# EAGLE design seeknobs5qtpy_22Feb2022 (EAGLE 9.6.2)
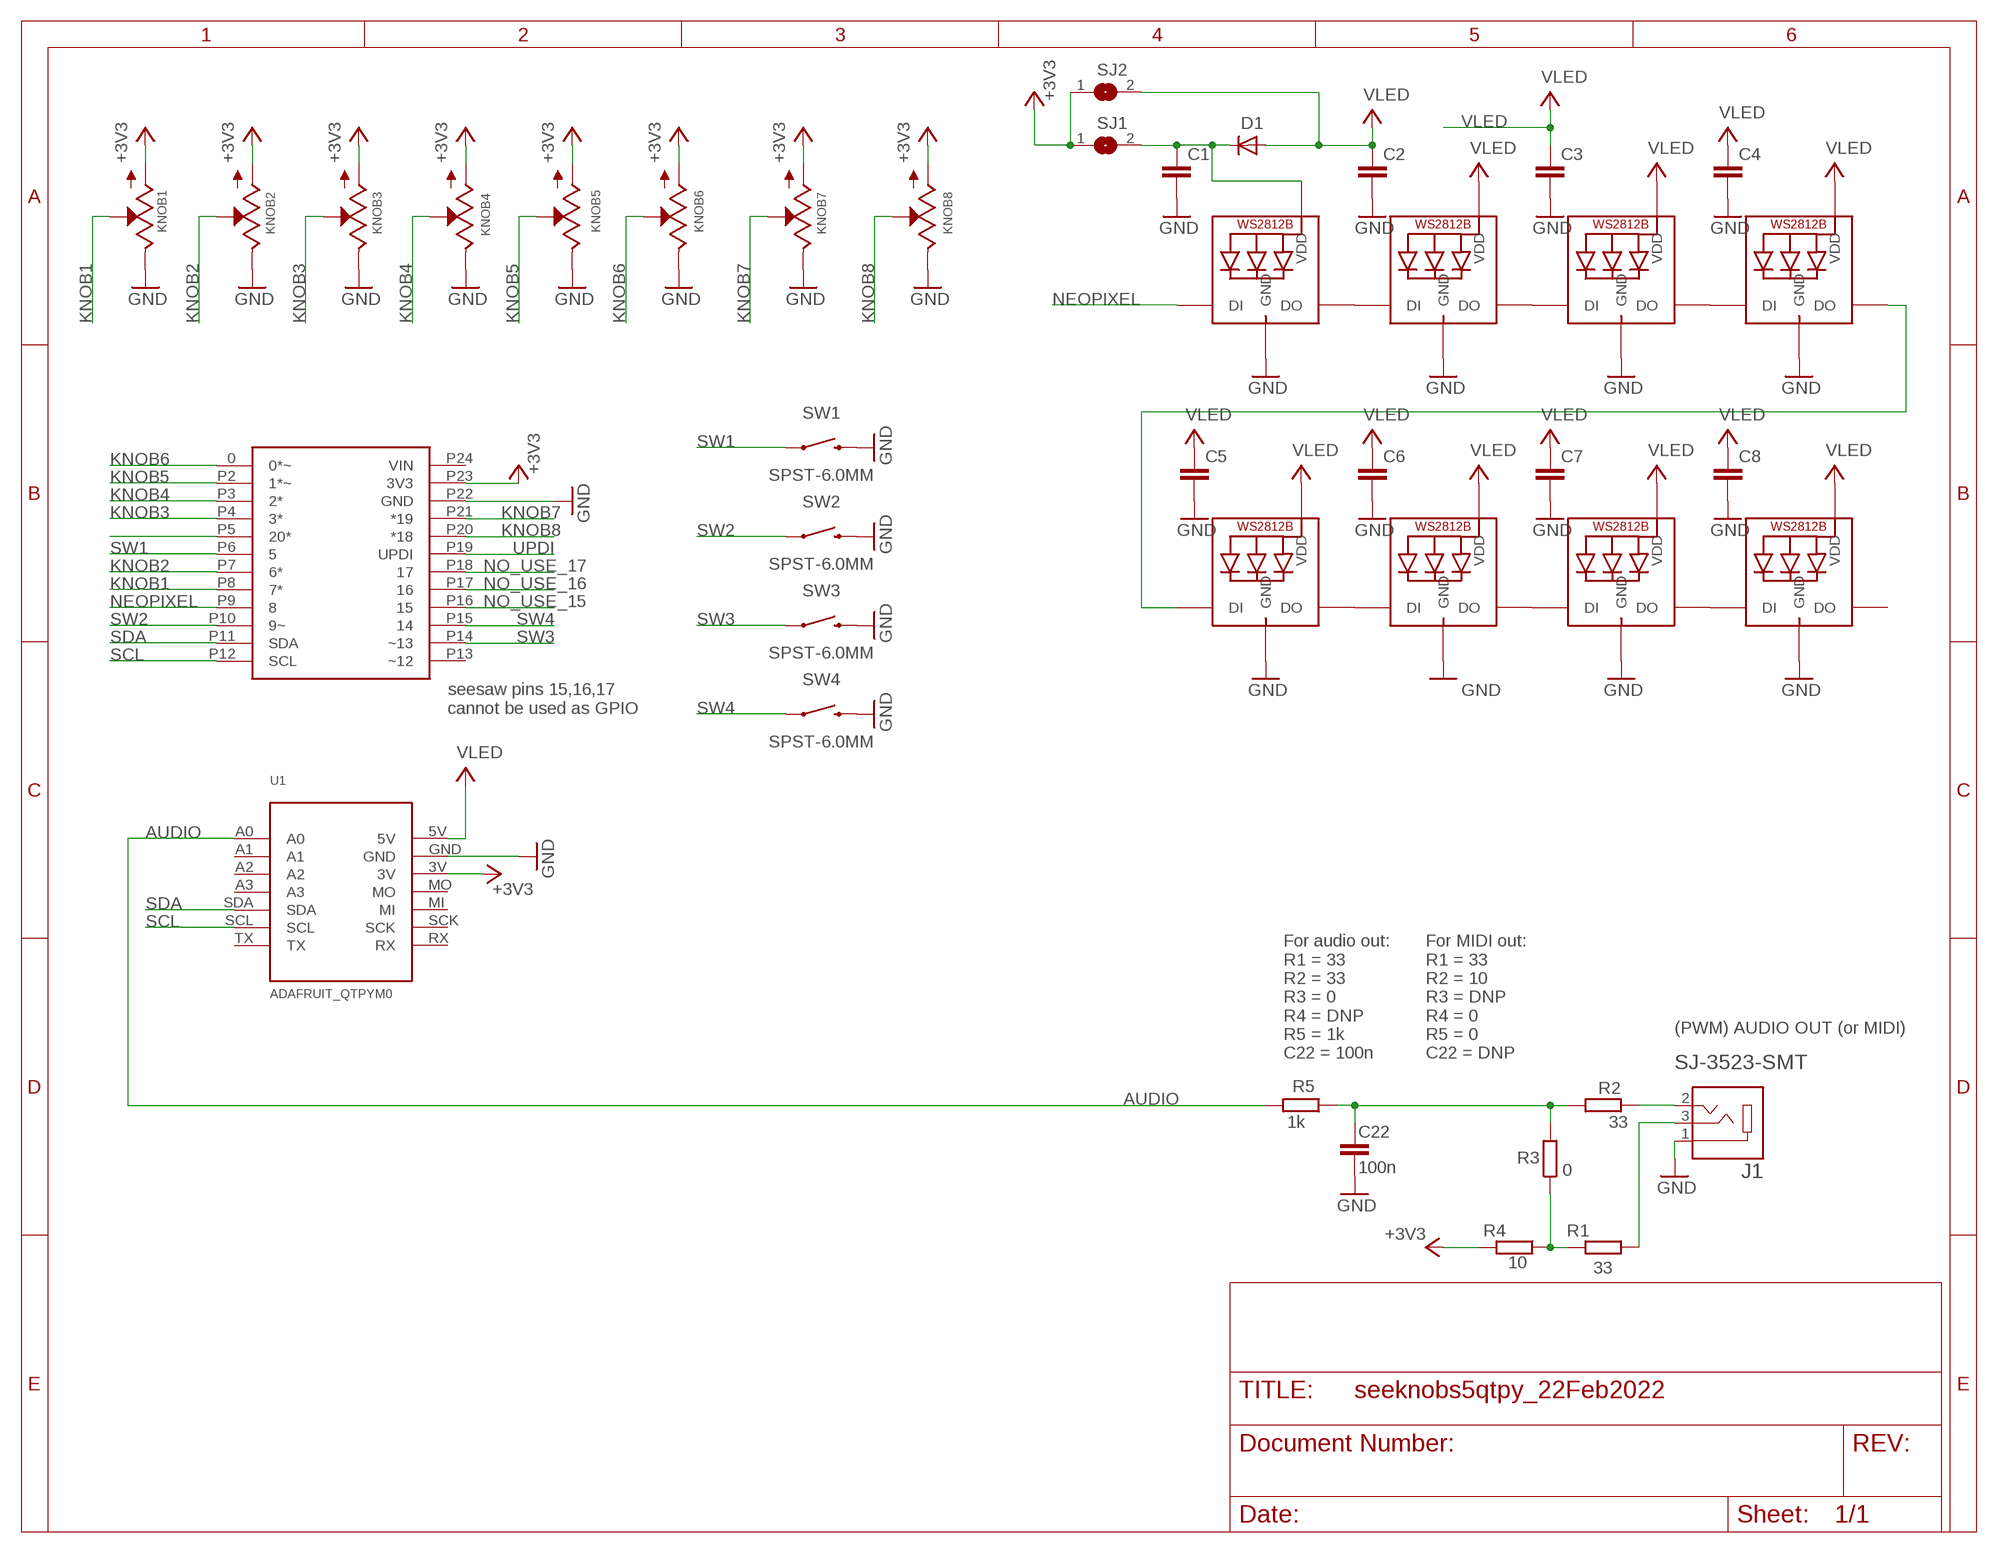
[diagram p0: schematic, sheet 1]

## Parts
C1  C-EUC0805  [C0805]
C2  C-EUC0805  [C0805]
C3  C-EUC0805  [C0805]
C4  C-EUC0805  [C0805]
C5  C-EUC0805  [C0805]
C6  C-EUC0805  [C0805]
C7  C-EUC0805  [C0805]
C8  C-EUC0805  [C0805]
C22  100n  C-EUC0805  [C0805]
D1  DIODESOD-123  [SOD-123]
J1  SJ-3523-SMT  [CUI_SJ-3523-SMT]
KNOB1  POT  [ALPS_POT]
KNOB2  POT  [ALPS_POT]
KNOB3  POT  [ALPS_POT]
KNOB4  POT  [ALPS_POT]
KNOB5  POT  [ALPS_POT]
KNOB6  POT  [ALPS_POT]
KNOB7  POT  [ALPS_POT]
KNOB8  POT  [ALPS_POT]
LED1  MICROBUILDER_WS2812B_SK6812E  [MICROBUILDER_NEO3535_REVERSE]
LED2  MICROBUILDER_WS2812B_SK6812E  [MICROBUILDER_NEO3535_REVERSE]
LED3  MICROBUILDER_WS2812B_SK6812E  [MICROBUILDER_NEO3535_REVERSE]
LED4  MICROBUILDER_WS2812B_SK6812E  [MICROBUILDER_NEO3535_REVERSE]
LED5  MICROBUILDER_WS2812B_SK6812E  [MICROBUILDER_NEO3535_REVERSE]
LED6  MICROBUILDER_WS2812B_SK6812E  [MICROBUILDER_NEO3535_REVERSE]
LED7  MICROBUILDER_WS2812B_SK6812E  [MICROBUILDER_NEO3535_REVERSE]
LED8  MICROBUILDER_WS2812B_SK6812E  [MICROBUILDER_NEO3535_REVERSE]
R1  33  R-EU_R0805  [R0805]
R2  33  R-EU_R0805  [R0805]
R3  0  R-EU_R0805  [R0805]
R4  10  R-EU_R0805  [R0805]
R5  1k  R-EU_R0805  [R0805]
SEESAW  ADAFRUIT_SEESAW_ATTINY817  [ADAFRUIT_SEESAW_ATTINY817]
SJ1  SJ  [SJ]
SJ2  SJ  [SJ]
SW1  SPST-6.0MM  MOMENTARY-SWITCH-SPST-PTH-6.0MM  [TACTILE_SWITCH_PTH_6.0MM]
SW2  SPST-6.0MM  MOMENTARY-SWITCH-SPST-PTH-6.0MM  [TACTILE_SWITCH_PTH_6.0MM]
SW3  SPST-6.0MM  MOMENTARY-SWITCH-SPST-PTH-6.0MM  [TACTILE_SWITCH_PTH_6.0MM]
SW4  SPST-6.0MM  MOMENTARY-SWITCH-SPST-PTH-6.0MM  [TACTILE_SWITCH_PTH_6.0MM]
U1  ADAFRUIT_QTPYM0  [ADAFRUIT_QTPY_M0]

## Nets
+3V3: KNOB1.P$3(A) KNOB2.P$3(A) KNOB3.P$3(A) KNOB4.P$3(A) KNOB5.P$3(A) KNOB6.P$3(A) KNOB7.P$3(A) KNOB8.P$3(A) R4.2 SEESAW.P23(3V3) SJ1.1 SJ2.1 U1.3V
AUDIO: R5.2 U1.A0
GND: C1.2 C2.2 C3.2 C4.2 C5.2 C6.2 C7.2 C8.2 C22.2 J1.1 KNOB1.P$1(E) KNOB2.P$1(E) KNOB3.P$1(E) KNOB4.P$1(E) KNOB5.P$1(E) KNOB6.P$1(E) KNOB7.P$1(E) KNOB8.P$1(E) LED1.3-GND(GND) LED2.3-GND(GND) LED3.3-GND(GND) LED4.3-GND(GND) LED5.3-GND(GND) LED6.3-GND(GND) LED7.3-GND(GND) LED8.3-GND(GND) SEESAW.P22(GND) SW1.3 SW2.3 SW3.3 SW4.3 U1.GND
KNOB1: KNOB1.P$2(S) SEESAW.P8(7*)
KNOB2: KNOB2.P$2(S) SEESAW.P7(6*)
KNOB3: KNOB3.P$2(S) SEESAW.P4(3*)
KNOB4: KNOB4.P$2(S) SEESAW.P3(2*)
KNOB5: KNOB5.P$2(S) SEESAW.P2(1*~)
KNOB6: KNOB6.P$2(S) SEESAW.0(0*~)
KNOB7: KNOB7.P$2(S) SEESAW.P21(*19)
KNOB8: KNOB8.P$2(S) SEESAW.P20(*18)
N$1: LED1.2-DOUT(DO) LED2.4-DIN(DI)
N$2: LED6.2-DOUT(DO) LED7.4-DIN(DI)
N$3: LED2.2-DOUT(DO) LED3.4-DIN(DI)
N$4: LED3.2-DOUT(DO) LED4.4-DIN(DI)
N$5: LED7.2-DOUT(DO) LED8.4-DIN(DI)
N$6: LED5.2-DOUT(DO) LED6.4-DIN(DI)
N$7: LED4.2-DOUT(DO) LED5.4-DIN(DI)
N$8: J1.3 R1.1
N$9: C1.1 D1.C LED1.1-VDD(VDD) SJ1.2
N$10: J1.2 R2.1
N$11: R1.2 R3.1 R4.1
N$12: SEESAW.P5(20*)
N$48: C22.1 R2.2 R3.2 R5.1
NEOPIXEL: LED1.4-DIN(DI) SEESAW.P9
NO_USE_15: SEESAW.P16
NO_USE_16: SEESAW.P17
NO_USE_17: SEESAW.P18
SCL: SEESAW.P12(SCL) U1.SCL
SDA: SEESAW.P11(SDA) U1.SDA
SW1: SEESAW.P6 SW1.1
SW2: SEESAW.P10(9~) SW2.1
SW3: SEESAW.P14(~13) SW3.1
SW4: SEESAW.P15 SW4.1
UPDI: SEESAW.P19(UPDI)
VLED: C2.1 C3.1 C4.1 C5.1 C6.1 C7.1 C8.1 D1.A LED2.1-VDD(VDD) LED3.1-VDD(VDD) LED4.1-VDD(VDD) LED5.1-VDD(VDD) LED6.1-VDD(VDD) LED7.1-VDD(VDD) LED8.1-VDD(VDD) SJ2.2 U1.5V
Unconnected: LED8.2-DOUT(DO) SEESAW.P13(~12) SEESAW.P24(VIN) U1.A1 U1.A2 U1.A3 U1.MI U1.MO U1.RX U1.SCK U1.TX

## Notes on the sheet
- seesaw pins 15,16,17 
  cannot be used as GPIO
- (PWM) AUDIO OUT (or MIDI)
- For audio out:
  R1 = 33
  R2 = 33
  R3 = 0
  R4 = DNP
  R5 = 1k
  C22 = 100n
- For MIDI out:
  R1 = 33
  R2 = 10
  R3 = DNP
  R4 = 0
  R5 = 0
  C22 = DNP

## Library data of the parts
C1-C8 C22 = rcl:C-EU: CAPACITOR, European symbol; SPICEPREFIX: C
D1 = adafruit:DIODE: Diode SMADIODE - SMA Surface Mount Package 20V 1A Schottky Diode Digikey: 641-1014-6-ND DO-1N4148 - Through Hole Small Current Diode SOD-123 20V 1 A (.5mV Vf) Schottky Diode - Digikey: MBRX120TPMSCT-ND SOD-323 10V 570mA (.38mV Vf, 3ns) Schottky Diode - Digikey: ZLLS410CT-ND SOD-523 30V 30mA Schottky Diode (RB751S-40TE61) - Digikey: RB751S-40TE61CT-ND SOT23-R/W - SOT23 Package (R = Solder Paste/Reflow Ovens, W = Hand-Soldering) BAT54Film 40V 300mA - Digikey: 497-7162-1-ND
J1 = SJ-3523-SMT:SJ-3523-SMT: Audio Jack Connector 3.5 mm Low Profile Surface Mount Stereo Jack, 3 Pin Right-Angle; CUI_PURCHASE_URL: https://www.cuidevices.com/product/interconnect/connectors/audio-connectors/jacks/sj-352x-smt-series?utm_source=snapeda.com&utm_medium=referral&utm_campaign=snapedaBOM; DESCRIPTION: 3.5 mm, Stereo, Right Angle, Surface Mount (SMT), 3 Conductors, 0~1 Internal Switches, Audio Jack Connector; DIGI-KEY_PART_NUMBER: CP-3523SJCT-ND; MF: CUI Devices; MP: SJ-3523-SMT-TR; PACKAGE: None; PURCHASE-URL: https://pricing.snapeda.com/search/part/SJ-3523-SMT-TR/?ref=eda
KNOB1-KNOB8 = EurorackModularParts:POT
LED1-LED8 = Adafruit MacroPad 2040:MICROBUILDER_WS2812B
R1-R5 = rcl:R-EU_: RESISTOR, European symbol; SPICEPREFIX: R
SEESAW = todstuff:ADAFRUIT_SEESAW_ATTINY817
SJ1 SJ2 = jumper:SJ: SMD solder JUMPER
SW1-SW4 = SparkFun-Switches:MOMENTARY-SWITCH-SPST: Momentary Switch (Pushbutton) - SPST Normally-open (NO) SPST momentary switches (buttons, pushbuttons). Variants PTH-12MM - 12mm square, through-hole Momentary Pushbutton Switch - 12mm Square <https://www.sparkfun.com/products/9190> (COM-09190) PTH-6.0MM, PTH-6.0MM-KIT - 6.0mm square, through-hole Mini Pushbutton Switch <https://www.sparkfun.com/products/97> (COM-00097) KIT package intended for soldering kit's - only one side of pads' copper is exposed. PTH-RIGHT-ANGLE-KIT - Right-angle, through-hole Right Angle Tactile Button <https://www.sparkfun.com/products/10791> - Used on SparkFun BigTime Watch Kit <https://www.sparkfun.com/products/11734> SMD-12MM - 12mm square, surface-mount Tactile Button - SMD (12mm) <https://www.sparkfun.com/products/12993> (COM-12993) Used on SparkFun PicoBoard <https://www.sparkfun.com/products/11888> SMD-4.5MM - 4.5mm Square Trackball Switch Used on SparkFun Blackberry Trackballer Breakout <https://www.sparkfun.com/products/13169> SMD-4.6MMX2.8MM - 4.60mm x 2.80mm, surface mount Used on SparkFun SAMD21 Mini Breakout <https://www.sparkfun.com/products/13664> SMD-5.2MM, SMD-5.2-REDUNDANT - 5.2mm square, surface-mount Mini Pushbutton Switch - SMD <https://www.sparkfun.com/products/8720> (COM-08720) Used on Arduino Pro Mini <https://www.sparkfun.com/products/11114> REDUNDANT package connects both switch circuits together SMD-6.0X3.5MM - 6.0 x 3.5mm, surface mount Momentary Reset Switch SMD <https://www.sparkfun.com/products/8229> (COM-08229) SMD-6.2MM-TALL - 6.2mm square, surface mount Tactile Button - SMD (6mm) <https://www.sparkfun.com/products/12992> Used on SparkFun Digital Sandbox <https://www.sparkfun.com/products/12651> SMD-RIGHT-ANGLE - Right-angle, surface mount Used on SparkFun Block for Intel® Edison - Arduino <https://www.sparkfun.com/products/13036>; PROD_ID: SWCH-08441; SF_SKU: COM-00097
U1 = todstuff:ADAFRUIT_QTPY

## Board
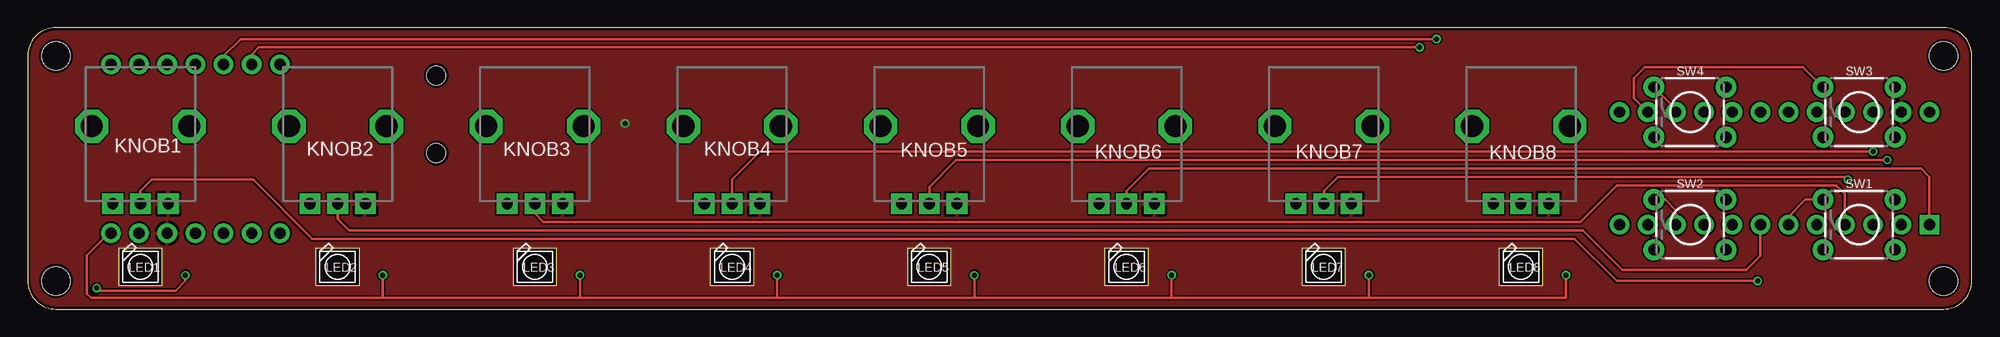
[diagram p1: board, top side]
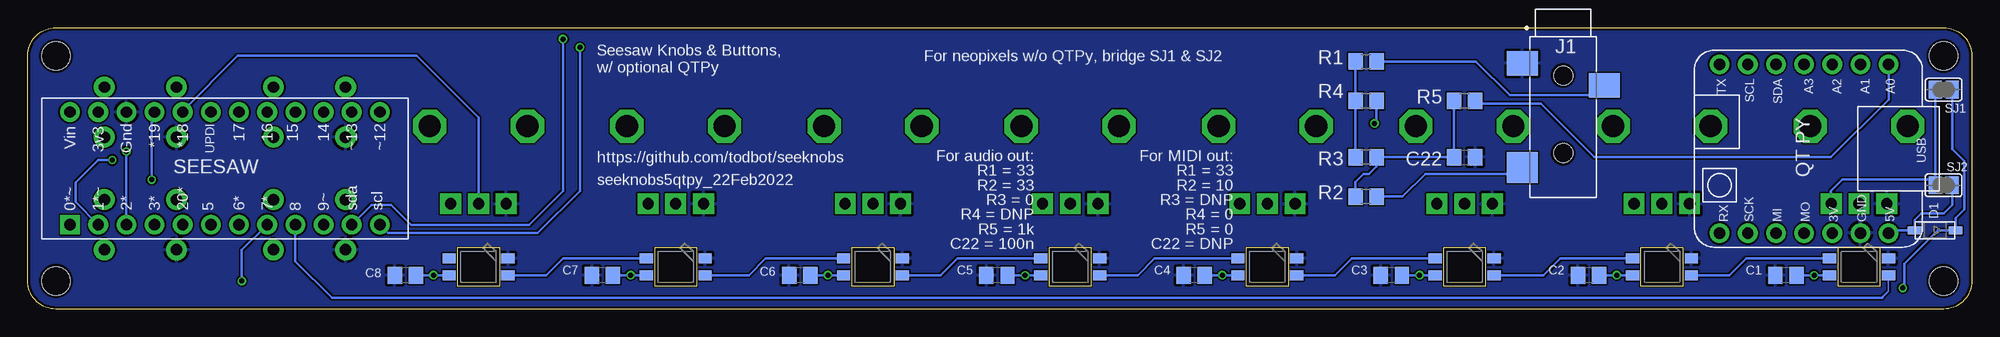
[diagram p2: board, bottom side, seen from below]

Size 175.26 x 25.4 mm. Coordinates in mm from the lower left corner, seen from the top.
Outline: 0,22.86 0,2.54 arc90 2.54,0 172.72,0 arc90 175.26,2.54 175.26,22.86 arc90 172.72,25.4 2.54,25.4 arc90 0,22.86
Copper layers (1*16): Top 0.035mm / dielectric 0.785mm / Bottom 0.035mm
Design rules "SeeedStudio_2layer_DRU_no_angle_20140221_blink1thin": minimum track width 6mil, minimum drill 12mil, track to track 6mil, track to pad 6mil, pad to pad 6mil, via to via 6mil, smd to smd 0mil, copper to edge 10mil, drill to drill 10mil, minimum pad ring 10mil, minimum via ring 6mil, stop-mask expansion 2mil, vias tented up to drill 100mil, thermal gap 10mil
Holes 2.54 mm at 172.72,22.86 172.72,2.54 2.54,2.54 2.54,22.86

### Footprints (pad centres in the part's own frame; a part is rotated, then mirrored left to right if it is on the bottom)
C0805 = smd 1.3 x 1.5: 1 -0.95,0; 2 0.95,0
SOD-123 = smd 1.2 x 0.7: A 1.85,0; C -1.85,0
CUI_SJ-3523-SMT = smd 2.2 x 2.8: 1 -1.1,-3.7; 3 0.9,3.7 | smd 2.8 x 2.8: 2 8.3,-3.7 | hole 1.7: 0,0; 7,0
ALPS_POT = drill 1 pad 1.88 square: P$1 7,-2.5; P$2 7,0; P$3 7,2.5 | drill 2 octagon: P$4 0,-4.4; P$5 0,4.4
MICROBUILDER_NEO3535_REVERSE = smd 1.2 x 0.9 bottom: 1-VDD 2.65,-0.75; 2-DOUT 2.65,0.75; 3-GND -2.65,0.75; 4-DIN -2.65,-0.75
R0805 = smd 1.3 x 1.5: 1 -0.95,0; 2 0.95,0
ADAFRUIT_SEESAW_ATTINY817 = drill 1.016 pad 1.778 square: 0 -5.08,13.97 | drill 1.016 pad 1.778: P2 -5.08,11.43; P3 -5.08,8.89; P4 -5.08,6.35; P5 -5.08,3.81; P6 -5.08,1.27; P7 -5.08,-1.27; P8 -5.08,-3.81; P9 -5.08,-6.35; P10 -5.08,-8.89; P11 -5.08,-11.43; P12 -5.08,-13.97; P13 5.08,-13.97; P14 5.08,-11.43; P15 5.08,-8.89; P16 5.08,-6.35; P17 5.08,-3.81; P18 5.08,-1.27; P19 5.08,1.27; P20 5.08,3.81; P21 5.08,6.35; P22 5.08,8.89; P23 5.08,11.43; P24 5.08,13.97
SJ = smd 1.168 x 1.6: 1 -0.762,0; 2 0.762,0
TACTILE_SWITCH_PTH_6.0MM = drill 1.016 pad 1.88: 1 -3.251,2.261; 2 3.251,2.261; 3 -3.251,-2.261; 4 3.251,-2.261
ADAFRUIT_QTPY_M0 = drill 1.016 pad 1.778: 3V 7.62,2.54; 5V 7.62,7.62; A0 -7.62,7.62; A1 -7.62,5.08; A2 -7.62,2.54; A3 -7.62,0; GND 7.62,5.08; MI 7.62,-2.54; MO 7.62,0; RX 7.62,-7.62; SCK 7.62,-5.08; SCL -7.62,-5.08; SDA -7.62,-2.54; TX -7.62,-7.62

### Placement (x,y rotation side)
C1  16.76,3.05 180 bottom
C2  34.54,3.05 180 bottom
C3  52.32,3.05 180 bottom
C4  70.1,3.05 180 bottom
C5  87.88,3.05 180 bottom
C6  105.66,3.05 180 bottom
C7  123.44,3.05 180 bottom
C8  141.22,3.05 180 bottom
C22  45.72,13.72 0 bottom
D1  3.3,7.11 180 bottom
J1  36.83,21.08 270 bottom
KNOB1  10.16,16.51 270 top
KNOB2  27.94,16.51 270 top
KNOB3  45.72,16.51 270 top
KNOB4  63.5,16.51 270 top
KNOB5  81.28,16.51 270 top
KNOB6  99.06,16.51 270 top
KNOB7  116.84,16.51 270 top
KNOB8  134.62,16.51 270 top
LED1  10.16,3.81 0 top
LED2  27.94,3.81 0 top
LED3  45.72,3.81 0 top
LED4  63.5,3.81 0 top
LED5  81.28,3.81 0 top
LED6  99.06,3.81 0 top
LED7  116.84,3.81 0 top
LED8  134.62,3.81 0 top
R1  54.61,22.35 180 bottom
R2  54.61,10.16 180 bottom
R3  54.61,13.72 0 bottom
R4  54.61,18.8 0 bottom
R5  45.72,18.8 0 bottom
SEESAW  157.48,12.7 90 bottom
SJ1  2.54,19.81 0 bottom
SJ2  2.54,11.18 0 bottom
SW1  165.1,7.62 0 top
SW2  149.86,7.62 0 top
SW3  165.1,17.78 0 top
SW4  149.86,17.78 0 top
U1  15.11,14.48 270 bottom

### Tracks (layer width: path | path; a pad name or v marks a point on that pad's centre or on a via)
+3V3  (via drill 0.45)
  Bottom 0.203: R4.2 53.66,16.95 v53.85,16.76 | KNOB1.P$3 12.7,9.55 12.7,10.67 11.68,11.68 3.81,11.68 SJ2.1 SJ1.1
  pour Top: 176.53,25.91 176.53,-1.02 -1.4,-1.02 -1.4,25.91
AUDIO
  Bottom 0.203: U1.A0 7.49,18.92 12.7,13.72 34.04,13.72 38.86,18.54 44.52,18.54 R5.2
GND
  pour Bottom: -1.27,25.91 176.53,25.91 176.53,-1.02 -1.27,-1.02
KNOB1  (via drill 0.45)
  Top 0.203: KNOB1.P$2 10.16,10.67 11.18,11.68 20.32,11.68 25.65,6.35 139.45,6.35 143.26,2.54 v155.96,2.54
  Bottom 0.203: SEESAW.P8 155.96,5.33 v155.96,2.54
KNOB2
  Top 0.203: KNOB2.P$2 27.94,8.13 28.96,7.11 140.21,7.11 143.76,3.56 154.94,3.56 156.21,4.83 SEESAW.P7
KNOB3
  Top 0.203: KNOB3.P$2 45.72,8.64 46.48,7.87 139.95,7.87 143.26,11.18 163.07,11.18 163.83,10.41 SEESAW.P4
KNOB4  (via drill 0.45)
  Top 0.203: KNOB4.P$2 63.5,11.68 66.04,14.22 v166.37,14.22
  Bottom 0.203: v166.37,14.22 SEESAW.P3
KNOB5  (via drill 0.45)
  Top 0.203: KNOB5.P$2 81.28,11.03 83.71,13.46 v167.64,13.46
  Bottom 0.203: v167.64,13.46 168.91,13.46 170.94,11.43 170.94,9.65 SEESAW.P2
KNOB6
  Top 0.203: KNOB6.P$2 99.06,10.67 101.09,12.7 170.69,12.7 171.45,11.94 SEESAW.0
KNOB7  (via drill 0.45)
  Top 0.203: KNOB7.P$2 116.84,10.67 118.11,11.94 163.83,11.94 v164.08,11.68
  Bottom 0.203: v164.08,11.68 164.08,17.53 SEESAW.P21
KNOB8
  Bottom 0.203: KNOB8.P$2 134.62,17.27 140.21,22.86 156.32,22.86 161.29,17.89 SEESAW.P20
N$1
  Bottom 0.152: 25.28,3.05 LED2.4-DIN
  Bottom 0.203: LED1.2-DOUT 20.33,4.56 21.84,3.05 25.28,3.05
N$2
  Bottom 0.203: LED6.2-DOUT 108.72,4.56 110.24,3.05 114.18,3.05 LED7.4-DIN
N$3
  Bottom 0.203: LED2.2-DOUT 37.1,4.56 38.61,3.05 43.06,3.05 LED3.4-DIN
N$4
  Bottom 0.203: LED4.4-DIN 60.84,3.05 57.4,3.05 55.89,4.56 LED3.2-DOUT
N$5
  Bottom 0.203: LED7.2-DOUT 119.5,4.57 127,4.57 128.52,3.05 131.96,3.05 LED8.4-DIN
N$6
  Bottom 0.152: 96.4,3.05 LED6.4-DIN
  Bottom 0.203: LED5.2-DOUT 91.45,4.56 92.96,3.05 96.4,3.05
N$7
  Bottom 0.203: LED4.2-DOUT 73.67,4.56 75.18,3.05 78.62,3.05 LED5.4-DIN
N$8
  Bottom 0.203: J1.3 33.26,20.05 34.01,19.3 41.66,19.3 44.7,22.35 R1.1
N$9  (via drill 0.45)
  Top 0.203: v14.21,3.05 14.21,2.54 13.32,1.65 6.48,1.65 v6.22,1.91
  Bottom 0.203: LED1.1-VDD v14.21,3.05 C1.1 | v6.22,1.91 6.1,2.03 6.1,4.06 3.05,7.11 D1.C 1.45,8.23 0.69,9 0.69,13.35 1.78,14.44 SJ1.2
N$10
  Bottom 0.203: J1.2 41.12,12.19 49.28,12.19 51.31,10.16 R2.1
N$11
  Bottom 0.203: R3.1 R4.1 R1.2
N$48
  Bottom 0.203: R5.1 C22.1 R3.2 53.66,12.89 54.36,12.19 54.86,12.19 55.56,11.5 R2.2
NEOPIXEL
  Bottom 0.152: LED1.4-DIN 7.51,1.58 8,1.09
  Bottom 0.203: SEESAW.P9 151.13,4.32 147.83,1.02 8.08,1.02 8,1.09
SCL  (via drill 0.45)
  Top 0.203: U1.SCL 20.19,22.99 20.83,23.62 v125.48,23.62
  Bottom 0.203: SEESAW.P12 142.75,6.86 129.29,6.86 125.48,10.67 v125.48,23.62
SDA  (via drill 0.45)
  Top 0.203: U1.SDA 17.65,22.86 19.18,24.38 v127,24.38
  Bottom 0.203: SEESAW.P11 144.27,9.4 142.49,9.4 140.72,7.62 130.05,7.62 127,10.67 v127,24.38
SW1
  Top 0.203: SW1.1 160.25,9.88 158.75,8.38 SEESAW.P6
SW2
  Top 0.203: SW2.1 147.62,9.88 148.59,8.91 SEESAW.P10
SW3
  Top 0.203: SEESAW.P14 144.78,19.05 144.78,20.83 145.8,21.84 160.04,21.84 SW3.1
SW4
  Top 0.203: SW4.1 148.59,18.06 SEESAW.P15
VLED  (via drill 0.45)
  Top 0.203: v49.78,3.06 49.78,1.02 | v67.56,3.06 67.56,1.02 | v85.34,3.05 85.34,1.02 | 103.12,1.02 v103.12,3.06 | v120.9,3.06 120.9,1.02 | v138.68,3.06 138.68,1.02 120.9,1.02 | 32,1.02 v32,3.06 | 120.9,1.02 103.12,1.02 | 103.12,1.02 85.34,1.02 | 85.34,1.02 67.56,1.02 | 67.56,1.02 49.78,1.02 | 49.78,1.02 32,1.02 | 32,1.02 5.71,1.02 5.34,1.39 5.34,4.83 7.37,6.86 U1.5V
  Bottom 0.203: LED2.1-VDD v32,3.06 C2.1 | LED3.1-VDD v49.78,3.06 C3.1 | LED4.1-VDD v67.56,3.06 C4.1 | LED5.1-VDD 83.94,3.05 v85.34,3.05 C5.1 | LED6.1-VDD v103.12,3.06 C6.1 | LED7.1-VDD v120.9,3.06 C7.1 | C8.1 v138.68,3.06 LED8.1-VDD | SJ2.2 1.78,9.4 2.54,8.64 4.57,8.64 5.15,8.06 D1.A 7.24,7.11 U1.5V

### Text on the board
bPlace: For neopixels w/o QTPy, bridge SJ1 & SJ2 | Seesaw Knobs & Buttons, / w/ optional QTPy | For MIDI out: / R1 = 33 / R2 = 10 / R3 = DNP / R4 = 0 / R5 = 0 / C22 = DNP | For audio out: / R1 = 33 / R2 = 33 / R3 = 0 / R4 = DNP / R5 = 1k / C22 = 100n | https://github.com/todbot/seeknobs | seeknobs5qtpy_22Feb2022
200bmp: /Users/tod/projects/synth/seeknobs/hardware/foo.bmp